# Altium schematic sheet universky-CONNECTOR.SchDoc
size A4
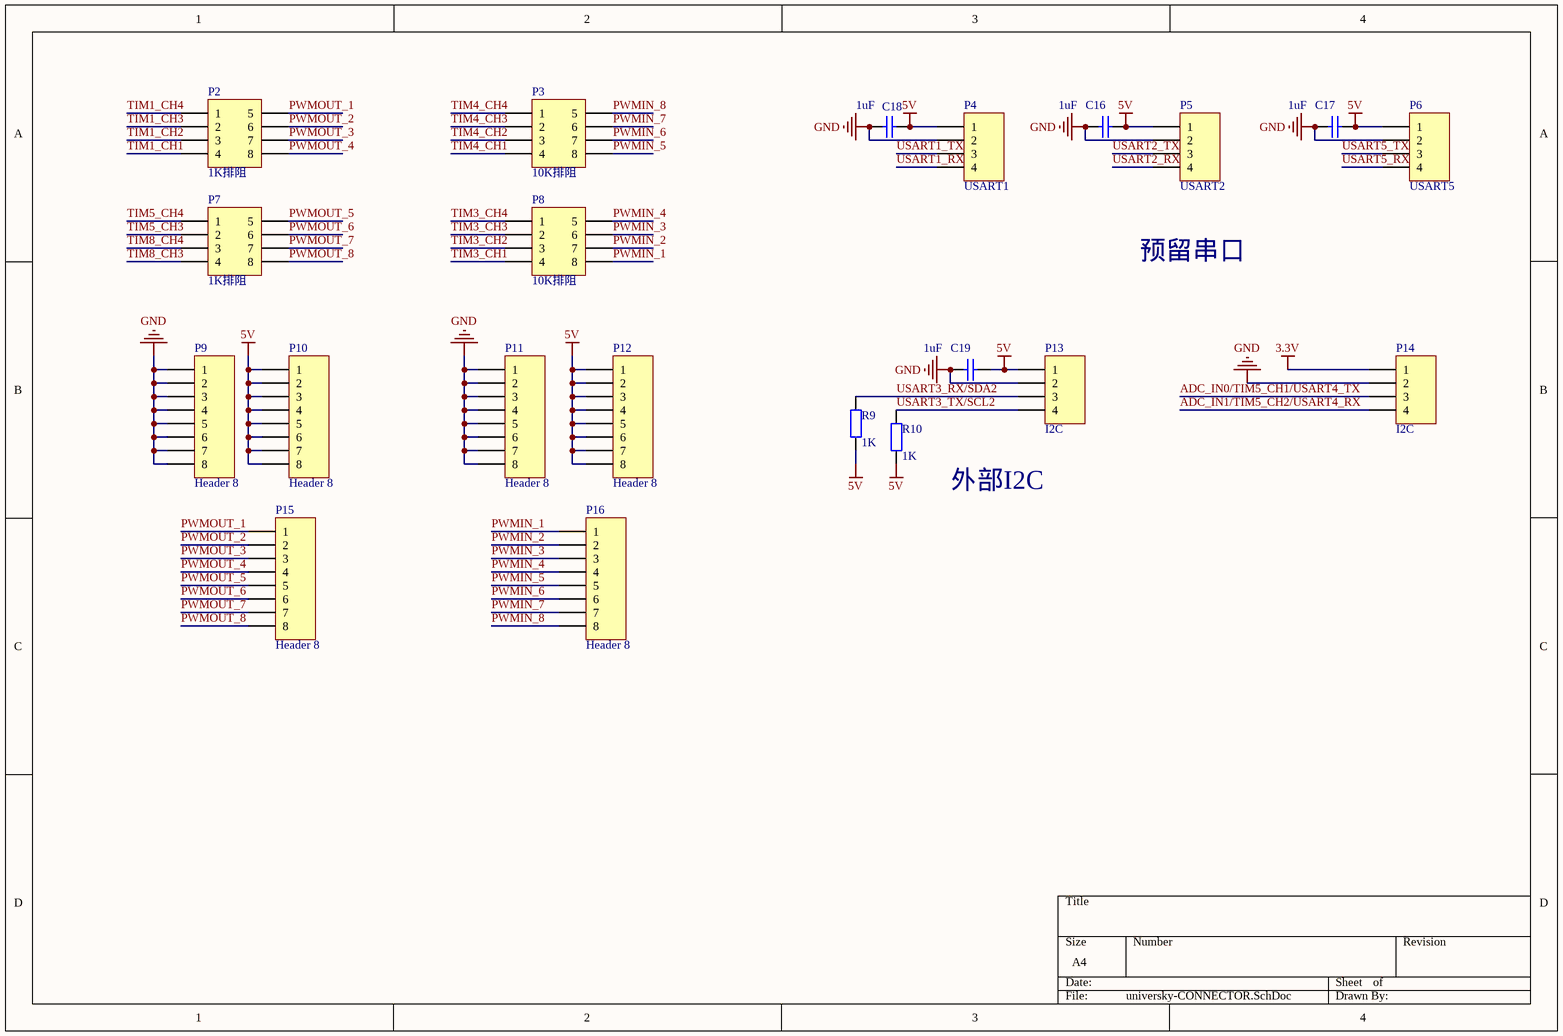
[diagram p0: universky-CONNECTOR.SchDoc]

## Parts
C16  value 1uF  [0603_C]  (hidden comment: Cap)
C17  value 1uF  [0603_C]  (hidden comment: Cap)
C18  value 1uF  [0603_C]  (hidden comment: Cap)
C19  value 1uF  [0603_C]  (hidden comment: Cap)
P2  1K排阻  [HDR_R_4]
P3  10K排阻  [HDR_R_4]
P4  USART1  [SMD-1.25]
P5  USART2  [SMD-1.25]
P6  USART5  [SMD-1.25]
P7  1K排阻  [HDR_R_4]
P8  10K排阻  [HDR_R_4]
P9  Header 8  [HDR1X8]
P10  Header 8  [HDR1X8]
P11  Header 8  [HDR1X8]
P12  Header 8  [HDR1X8]
P13  I2C  [SMD-1.25]
P14  I2C  [SMD-1.25]
P15  Header 8  [HDR1X8]
P16  Header 8  [HDR1X8]
R9  value 1K  [0603_R]  (hidden comment: Res2)
R10  value 1K  [0603_R]  (hidden comment: Res2)

## Nets
3.3V: P14.1
5V: C16.1 C17.1 C18.1 C19.1 P4.1 P5.1 P6.1 P10.1 P10.2 P10.3 P10.4 P10.5 P10.6 P10.7 P10.8 P12.1 P12.2 P12.3 P12.4 P12.5 P12.6 P12.7 P12.8 P13.1 R9.1 R10.1
GND: C16.2 C17.2 C18.2 C19.2 P4.2 P5.2 P6.2 P9.1 P9.2 P9.3 P9.4 P9.5 P9.6 P9.7 P9.8 P11.1 P11.2 P11.3 P11.4 P11.5 P11.6 P11.7 P11.8 P13.2 P14.2
ADC_IN0/TIM5_CH1/USART4_TX: P14.3
ADC_IN1/TIM5_CH2/USART4_RX: P14.4
PWMIN_1: P8.8 P16.1
PWMIN_2: P8.7 P16.2
PWMIN_3: P8.6 P16.3
PWMIN_4: P8.5 P16.4
PWMIN_5: P3.8 P16.5
PWMIN_6: P3.7 P16.6
PWMIN_7: P3.6 P16.7
PWMIN_8: P3.5 P16.8
PWMOUT_1: P2.5 P15.1
PWMOUT_2: P2.6 P15.2
PWMOUT_3: P2.7 P15.3
PWMOUT_4: P2.8 P15.4
PWMOUT_5: P7.5 P15.5
PWMOUT_6: P7.6 P15.6
PWMOUT_7: P7.7 P15.7
PWMOUT_8: P7.8 P15.8
TIM1_CH1: P2.4
TIM1_CH2: P2.3
TIM1_CH3: P2.2
TIM1_CH4: P2.1
TIM3_CH1: P8.4
TIM3_CH2: P8.3
TIM3_CH3: P8.2
TIM3_CH4: P8.1
TIM4_CH1: P3.4
TIM4_CH2: P3.3
TIM4_CH3: P3.2
TIM4_CH4: P3.1
TIM5_CH3: P7.2
TIM5_CH4: P7.1
TIM8_CH3: P7.4
TIM8_CH4: P7.3
USART1_RX: P4.4
USART1_TX: P4.3
USART2_RX: P5.4
USART2_TX: P5.3
USART3_RX/SDA2: P13.3 R9.2
USART3_TX/SCL2: P13.4 R10.2
USART5_RX: P6.4
USART5_TX: P6.3

## Notes on the sheet
- 预留串口
- 外部I2C

## Library data of the parts
C16-C19 = Cap: Capacitor; Published: 8-Jun-2000; LatestRevisionDate: 17-Jul-2002; LatestRevisionNote: Re-released for DXP Platform.; PackageReference: RAD-0.3; Publisher: Altium Limited; PackageDescription: Radial Cap, Thru-Hole; 2 Leads; 0.3 in Pin Spacing
P2 P3 P7 P8 = Header 4X2A: Header, 4-Pin, Dual row; LatestRevisionDate: 17-Jul-2002; LatestRevisionNote: Re-released for DXP Platform.; Publisher: Altium Limited
P4-P6 P13 P14 = Header 4: Header, 4-Pin; LatestRevisionDate: 17-Jul-2002; LatestRevisionNote: Re-released for DXP Platform.; Publisher: Altium Limited
P9-P12 P15 P16 = Header 8: Header, 8-Pin; LatestRevisionDate: 17-Jul-2002; LatestRevisionNote: Re-released for DXP Platform.; Publisher: Altium Limited
R9 R10 = Res2: Resistor; Published: 8-Jun-2000; LatestRevisionDate: 17-Jul-2002; LatestRevisionNote: Re-released for DXP Platform.; PackageReference: AXIAL-0.4; Publisher: Altium Limited; PackageDescription: Axial Device, Thru-Hole; 2 Leads; 0.4 in Pin Spacing